# EAGLE design ESP32-XTonUINO (EAGLE 6.6.0)
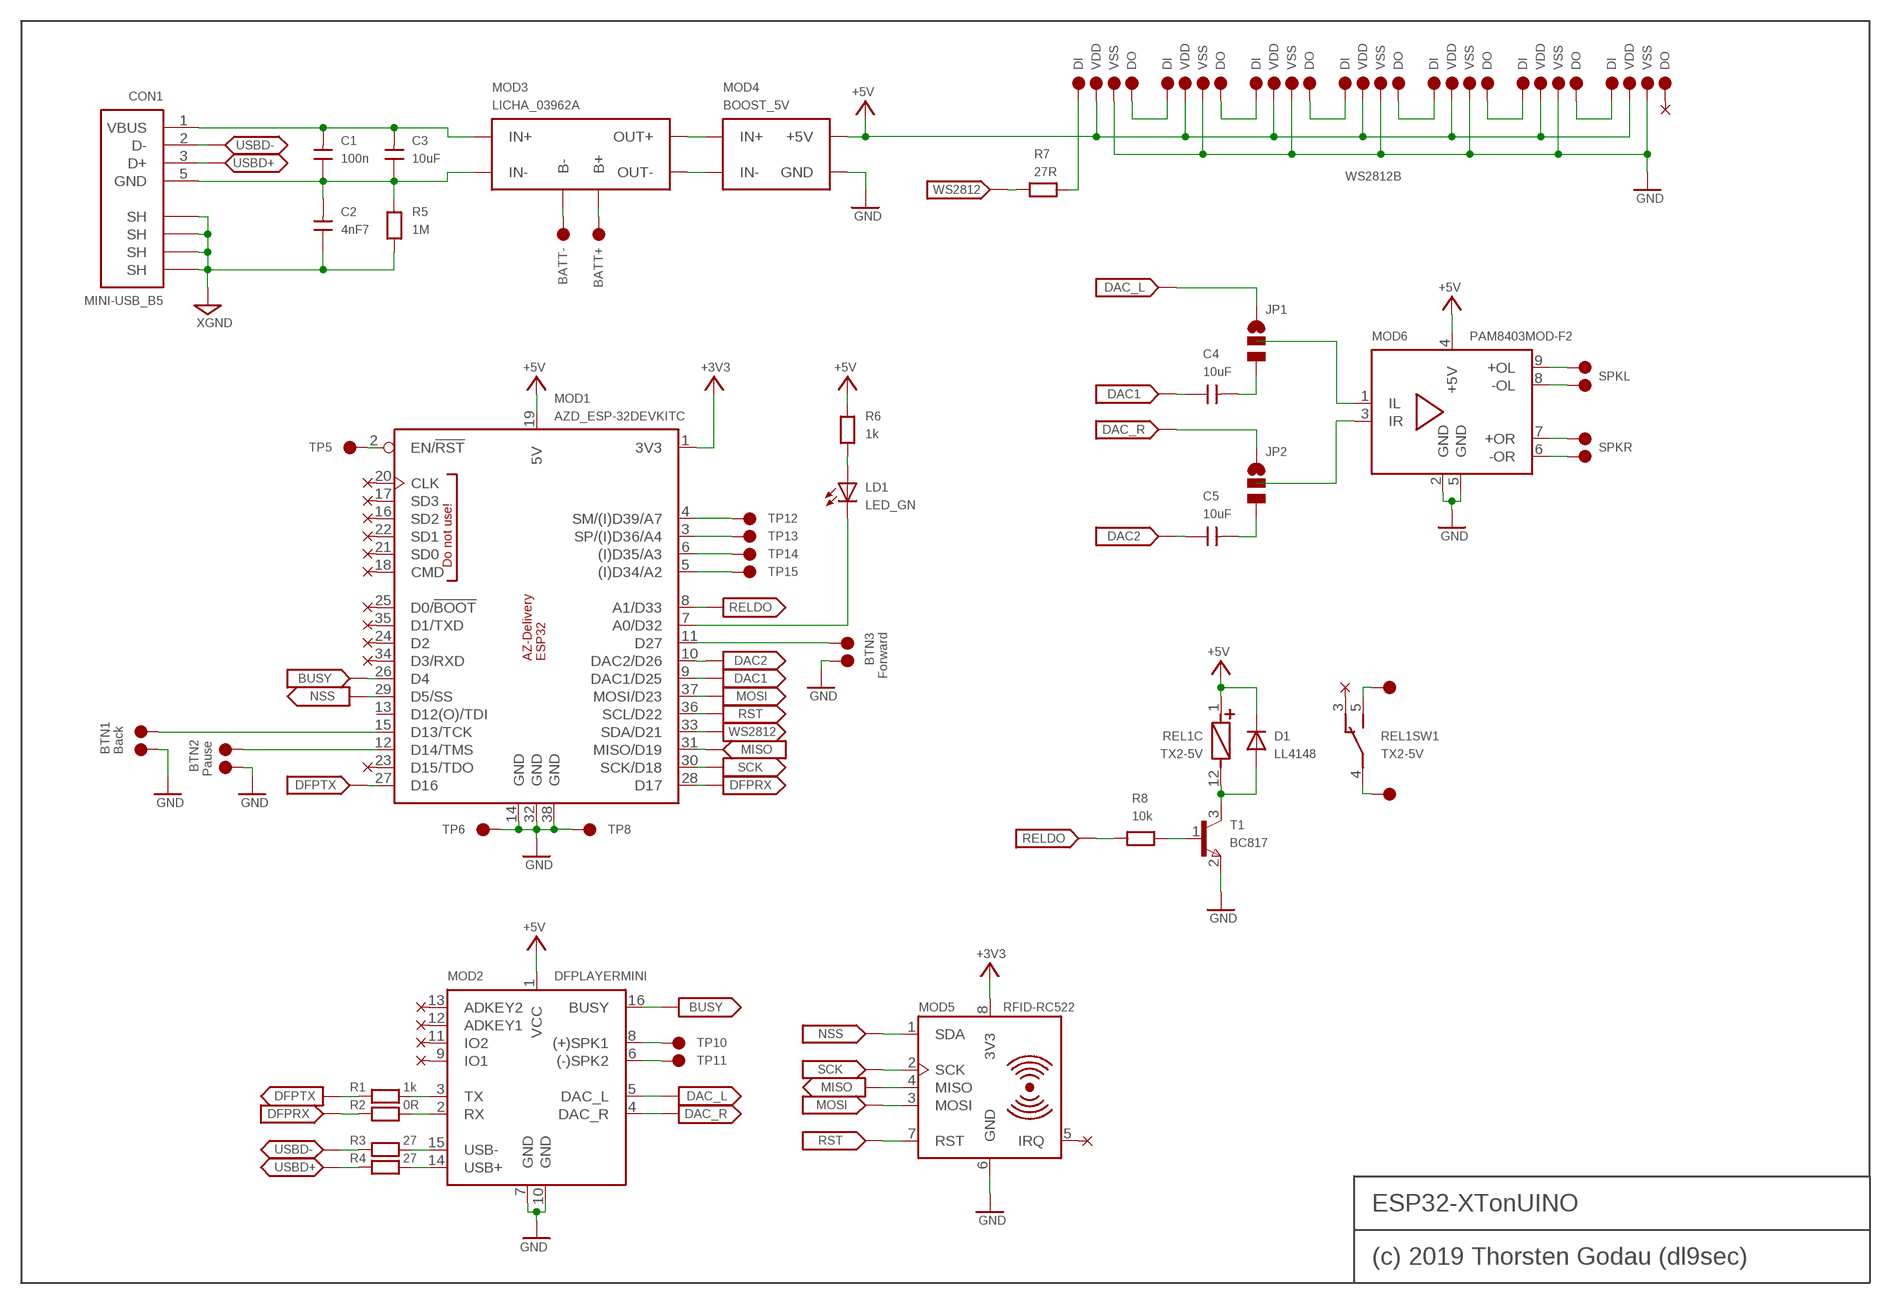
[diagram p0: schematic, sheet 1]

## Parts
C1  100n  C0805  [0805]
C2  4nF7  C0805  [0805]
C3  10uF  C0805  [0805]
C4  10uF  C0805  [0805]
C5  10uF  C0805  [0805]
CON1  MINI-USB_B5  [MINIUSB_B5]
D1  LL4148  [MINIMELF]
JP1  JUMPER_1X3SMD  [JUMPER_1X3_SMD]
JP2  JUMPER_1X3SMD  [JUMPER_1X3_SMD]
LD1  LED_GN  LED_3MM_GN_H  [LED3MMH]
MOD1  AZD_ESP-32DEVKITC  [AZD_ESP-32DEVKITC]
MOD2  DFPLAYERMINI  [DFPLAYERMINI]
MOD3  LICHA_03962A  [LICHA_03962A]
MOD4  BOOST_5V  [BOOST_5V]
MOD5  RFID-RC522  [RFID-RC522]
MOD6  PAM8403MOD-F2  [PAM8403MOD2]
R1  1k  R0805  [0805]
R2  0R  R0805  [0805]
R3  27  R0805  [0805]
R4  27  R0805  [0805]
R5  1M  R0805  [0805]
R6  1k  R0805  [0805]
R7  27R  R0805  [0805]
R8  10k  R0805  [0805]
REL1  TX2-5V  [RELTX2]
T1  BC817  BTUN  [SOT23]
TP1  TESTPINTHT1  [TESTPIN_THT1]
TP2  TESTPINTHT1  [TESTPIN_THT1]
TP3  TESTPINTHT1  [TESTPIN_THT1]
TP4  TESTPINTHT1  [TESTPIN_THT1]
TP5  TESTPINTHT1  [TESTPIN_THT1]
TP6  TESTPINTHT1  [TESTPIN_THT1]
TP7  TESTPINTHT1  [TESTPIN_THT1]
TP8  TESTPINTHT1  [TESTPIN_THT1]
TP9  TESTPINTHT1  [TESTPIN_THT1]
TP10  TESTPINTHT2  [TESTPIN_THT2]
TP11  TESTPINTHT2  [TESTPIN_THT2]
TP12  TESTPINTHT1  [TESTPIN_THT1]
TP13  TESTPINTHT1  [TESTPIN_THT1]
TP14  TESTPINTHT1  [TESTPIN_THT1]
TP15  TESTPINTHT1  [TESTPIN_THT1]
TP16  TESTPINTHT1  [TESTPIN_THT1]
TP17  TESTPINTHT1  [TESTPIN_THT1]
TP18  TESTPINTHT1  [TESTPIN_THT1]
TP19  TESTPINTHT1  [TESTPIN_THT1]
TP20  TESTPINTHT1  [TESTPIN_THT1]
TP21  TESTPINTHT1  [TESTPIN_THT1]
TP22  TESTPINTHT1  [TESTPIN_THT1]
TP23  TESTPINTHT1  [TESTPIN_THT1]
TP24  TESTPINTHT1  [TESTPIN_THT1]
TP25  TESTPINTHT1  [TESTPIN_THT1]
TP26  TESTPINTHT1  [TESTPIN_THT1]
TP27  TESTPINTHT1  [TESTPIN_THT1]
TP28  TESTPINTHT1  [TESTPIN_THT1]
TP29  TESTPINTHT1  [TESTPIN_THT1]
TP30  TESTPINTHT1  [TESTPIN_THT1]
TP31  TESTPINTHT1  [TESTPIN_THT1]
TP32  TESTPINTHT1  [TESTPIN_THT1]
TP33  TESTPINTHT1  [TESTPIN_THT1]
TP34  TESTPINTHT1  [TESTPIN_THT1]
TP35  TESTPINTHT1  [TESTPIN_THT1]
TP36  TESTPINTHT1  [TESTPIN_THT1]
TP37  TESTPINTHT1  [TESTPIN_THT1]
TP38  TESTPINTHT1  [TESTPIN_THT1]
TP39  TESTPINTHT1  [TESTPIN_THT1]
TP40  TESTPINTHT1  [TESTPIN_THT1]
TP41  TESTPINTHT2  [TESTPIN_THT2]
TP42  TESTPINTHT2  [TESTPIN_THT2]
TP43  TESTPINTHT2  [TESTPIN_THT2]
TP44  TESTPINTHT2  [TESTPIN_THT2]
TP45  TESTPINTHT1  [TESTPIN_THT1]
TP46  TESTPINTHT2  [TESTPIN_THT2]
TP47  TESTPINTHT2  [TESTPIN_THT2]
TP48  TESTPINTHT1  [TESTPIN_THT1]
TP49  TESTPINTHT1  [TESTPIN_THT1]
TP50  TESTPINTHT1  [TESTPIN_THT1]
TP51  TESTPINTHT1  [TESTPIN_THT1]

## Nets
+3V3: MOD1.1(3V3) MOD5.8(3V3)
+5V: D1.K MOD1.19(5V) MOD2.1(VCC) MOD4.+5V MOD6.4(+5V) R6.2 REL1.1(C:+) TP19.1(TP) TP23.1(TP) TP27.1(TP) TP31.1(TP) TP35.1(TP) TP39.1(TP) TP49.1(TP)
BATT+: MOD3.B+ TP9.1(TP)
BATT-: MOD3.B- TP7.1(TP)
BTN1: MOD1.15(D13/TCK) TP1.1(TP)
BTN2: MOD1.12(D14/TMS) TP3.1(TP)
BTN3: MOD1.11(D27) TP16.1(TP)
BUSY: MOD1.26(D4) MOD2.16(BUSY)
DAC1: C4.1 MOD1.9(DAC1/D25)
DAC2: C5.1 MOD1.10(DAC2/D26)
DAC_L: JP1.1 MOD2.5(DAC_L)
DAC_R: JP2.1 MOD2.4(DAC_R)
DFPRX: MOD1.28(D17) R2.1
DFPTX: MOD1.27(D16) R1.1
GND: MOD1.14(GND) MOD1.32(GND) MOD1.38(GND) MOD2.7(GND) MOD2.10(GND) MOD4.GND MOD5.6(GND) MOD6.2(GND) MOD6.5(GND) T1.2(E) TP2.1(TP) TP4.1(TP) TP6.1(TP) TP8.1(TP) TP17.1(TP) TP20.1(TP) TP24.1(TP) TP28.1(TP) TP32.1(TP) TP36.1(TP) TP40.1(TP) TP50.1(TP)
MISO: MOD1.31(MISO/D19) MOD5.4(MISO)
MOSI: MOD1.37(MOSI/D23) MOD5.3(MOSI)
N$1: C1.1 C2.2 C3.1 CON1.5(GND) MOD3.IN- R5.2
N$2: MOD2.14(USB+) R4.2
N$3: MOD1.4(SM/(I)D39/A7) TP12.1(TP)
N$4: MOD1.3(SP/(I)D36/A4) TP13.1(TP)
N$5: MOD3.OUT- MOD4.IN-
N$6: MOD1.6((I)D35/A3) TP14.1(TP)
N$7: MOD1.5((I)D34/A2) TP15.1(TP)
N$8: MOD1.2(EN/!RST!) TP5.1(TP)
N$9: C4.2 JP1.3
N$10: LD1.A R6.1
N$11: JP2.2 MOD6.3(IR)
N$12: MOD2.15(USB-) R3.2
N$13: JP1.2 MOD6.1(IL)
N$14: C5.2 JP2.3
N$15: TP21.1(TP) TP22.1(TP)
N$16: MOD6.9(+OL) TP41.1(TP)
N$17: MOD2.2(RX) R2.2
N$18: MOD2.3(TX) R1.2
N$19: MOD6.8(-OL) TP42.1(TP)
N$20: MOD6.7(+OR) TP43.1(TP)
N$21: MOD6.6(-OR) TP44.1(TP)
N$22: TP25.1(TP) TP26.1(TP)
N$23: TP29.1(TP) TP30.1(TP)
N$24: TP33.1(TP) TP34.1(TP)
N$25: TP37.1(TP) TP38.1(TP)
N$26: TP45.1(TP) TP48.1(TP)
N$27: REL1.4(SW1:COM) TP47.1(TP)
N$28: REL1.5(SW1:NO) TP46.1(TP)
N$29: R7.2 TP18.1(TP)
N$30: D1.A REL1.12(C:-) T1.3(C)
N$31: R8.2 T1.1(B)
NLED: LD1.K MOD1.7(A0/D32)
NSS: MOD1.29(D5/SS) MOD5.1(SDA)
OUT+: MOD3.OUT+ MOD4.IN+
RELDO: MOD1.8(A1/D33) R8.1
RST: MOD1.36(SCL/D22) MOD5.7(RST)
SCK: MOD1.30(SCK/D18) MOD5.2(SCK)
SPK+: MOD2.8((+)SPK1) TP10.1(TP)
SPK-: MOD2.6((-)SPK2) TP11.1(TP)
USBD+: CON1.3(D+) R4.1
USBD-: CON1.2(D-) R3.1
VBUS: C1.2 C3.2 CON1.1(VBUS) MOD3.IN+
WS2812: MOD1.33(SDA/D21) R7.1
XGND: C2.1 CON1.S1(SH) CON1.S2(SH) CON1.S3(SH) CON1.S4(SH) R5.1
Unconnected: MOD1.13(D12(O)/TDI) MOD1.16(SD2) MOD1.17(SD3) MOD1.18(CMD) MOD1.20(CLK) MOD1.21(SD0) MOD1.22(SD1) MOD1.23(D15/TDO) MOD1.24(D2) MOD1.25(D0/!BOOT!) MOD1.34(D3/RXD) MOD1.35(D1/TXD) MOD2.9(IO1) MOD2.11(IO2) MOD2.12(ADKEY1) MOD2.13(ADKEY2) MOD5.5(IRQ) REL1.3(SW1:NC) REL1.8(SW2:NO) REL1.9(SW2:COM) REL1.10(SW2:NC) TP51.1(TP)

## Notes on the sheet
- DI | VDD | VSS | DO | DI | VDD | VSS | DO | DI | VDD | VSS | DO | DI | VDD | VSS | DO | DI | VDD | VSS | DO | DI | VDD | VSS | DO | DI | VDD | VSS | DO
- WS2812B
- BATT- | BATT+
- SPKL
- SPKR
- BTN3
- Forward
- BTN1 | Back
- BTN2
- Pause
- ESP32-XTonUINO
- (c) 2019 Thorsten Godau (dl9sec)

## Library data of the parts
C1-C5 = dl9sec_public:C: Capacity
CON1 = dl9sec_public:MINI-USB_B5: KYCON Mini-USB Type B SMT, 5-pins 4 pins for shield
D1 = dl9sec_public:LL4148: LL4148 General purpose diode
JP1 JP2 = dl9sec_public:JUMPER_1X3: Jumper 1x3
LD1 = dl9sec_public:LED_3MM_GN: LED (green) Kingbright L-934SGC
MOD1 = dl9sec_public:AZD_ESP-32DEVKITC: AZ-Delivery ESP-32 DevKitC https://www.az-delivery.de/products/esp32-developmentboard?ls=de&cache=false https://cdn.shopify.com/s/files/1/1509/1638/files/ESP_-_32_NodeMCU_Developmentboard_Pinout_Diagram.jpg?4479111012146266271 https://bibliothek.az-delivery.de/wp-content/uploads/2018/01/4-AZ-Delivery_ESP32-Development-Board_Startertutorial.pdf
MOD2 = dl9sec_public:DFPLAYERMINI: AZ-Delivery DFPlayer Mini https://www.az-delivery.de/products/mp3-player-modul
MOD3 = dl9sec_public:LICHA_03962A: LiIon/LiPo 1-cell charger 1A with UVP TP4056, DW01A/FS8205A
MOD4 = dl9sec_public:BOOST_5V: Boost converter module 1..5V -> 5V
MOD5 = dl9sec_public:RFID-RC522: AZ-Dekivery RFID-RC522 https://www.az-delivery.de/products/rfid-set
MOD6 = dl9sec_public:PAM8403MOD: PAM8403 module 2x3W@4R
R1-R8 = dl9sec_public:R: Resistor
REL1 = dl9sec_public:TX2: Panasonix TX2 relay https://www.panasonic-electric-works.com/pew/de/downloads/ds_61022_en_tx.pdf
T1 = dl9sec_public:BTUN: Bipolar transistor universal NPN BTUN
TP1-TP51 = dl9sec_public:TESTPIN: Testpin/Testpad

## Board
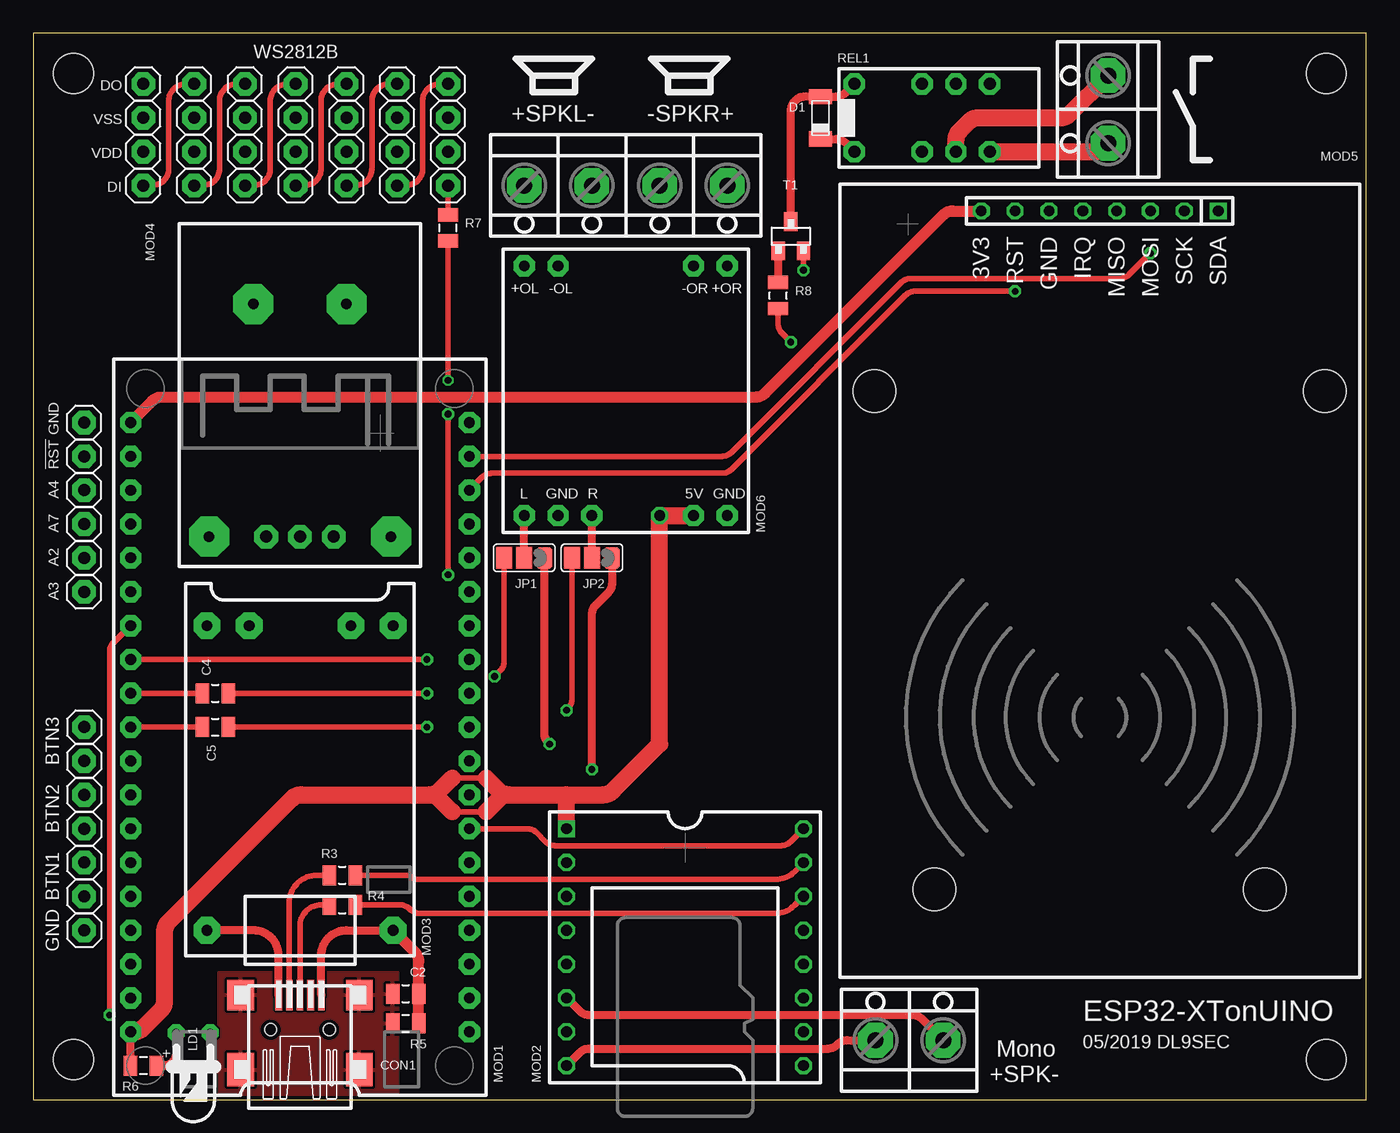
[diagram p1: board, top side]
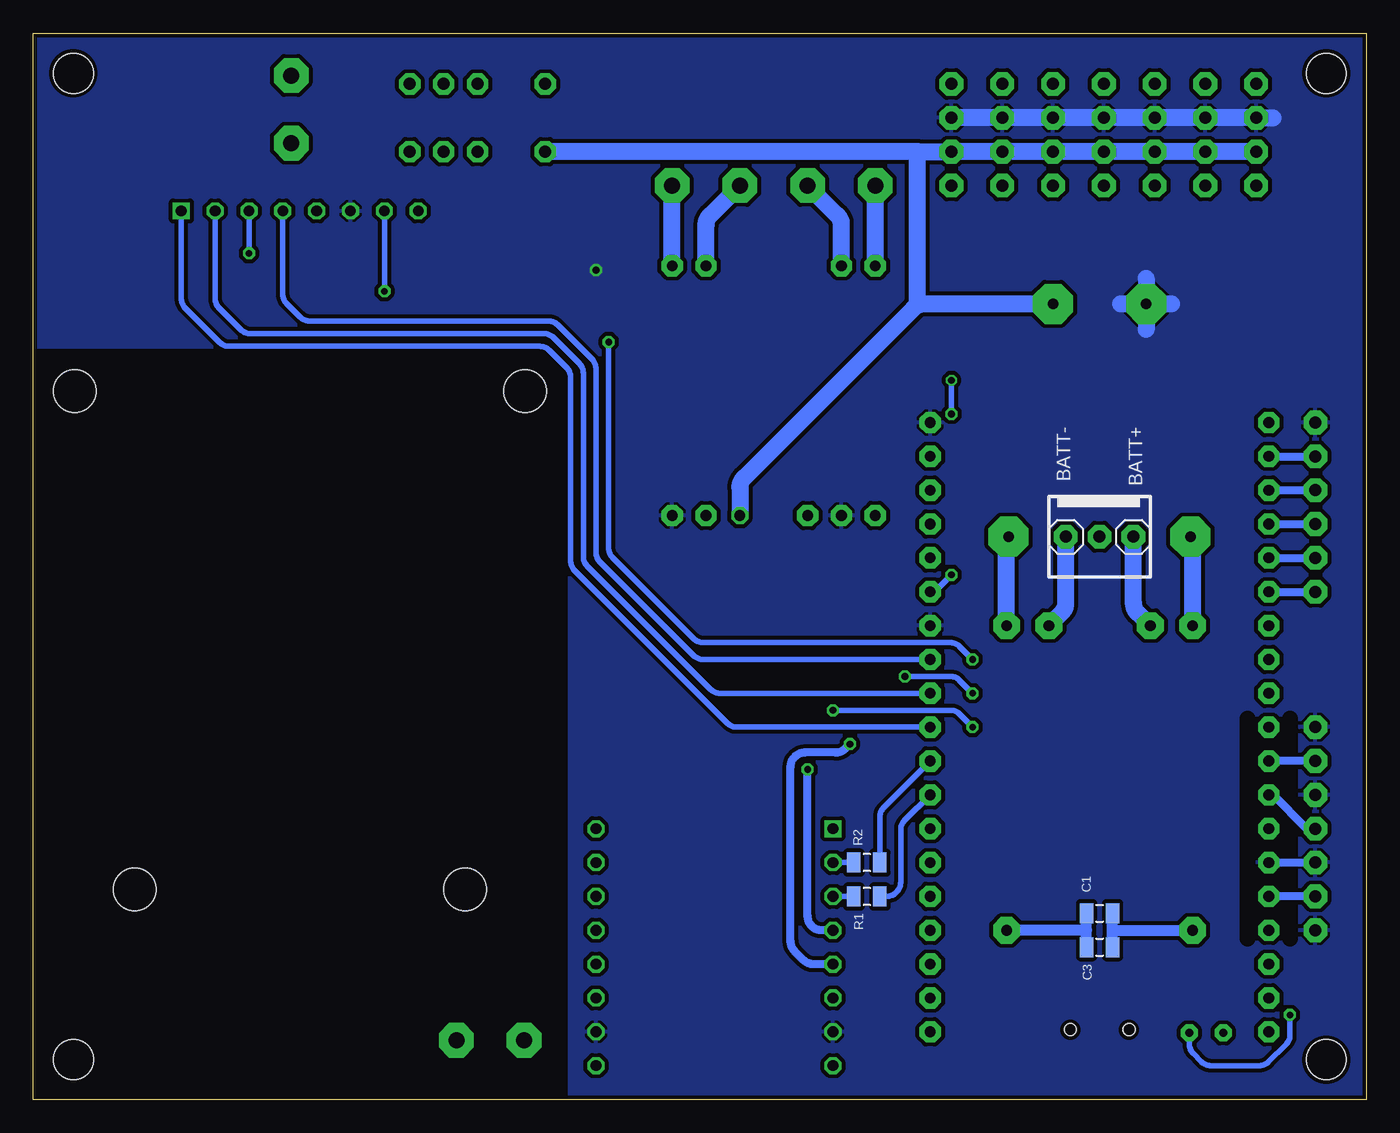
[diagram p2: board, bottom side, seen from below]

Size 100 x 80 mm. Coordinates in mm from the lower left corner, seen from the top.
Outline: 0,0 100,0 100,80 0,80 0,0
Copper layers (1*16): Top 0.035mm / dielectric 1.5mm / Bottom 0.035mm
Design rules "PCB-POOL Standard_tg": minimum track width 0.15mm, minimum drill 0.3mm, track to track 0.15mm, track to pad 0.15mm, pad to pad 0.15mm, via to via 0.15mm, smd to smd 0.15mm, copper to edge 0.3mm, drill to drill 0.2mm, minimum pad ring 0.2mm, minimum via ring 0.15mm, stop-mask expansion 0.075mm, vias tented up to drill 0.5mm, thermal gap 0.2mm
Holes 3 mm at 3,3 3,77 97,77 97,3
bRestrict: 21 lines

### Footprints (pad centres in the part's own frame; a part is rotated, then mirrored left to right if it is on the bottom)
0805 = smd 1 x 1.5: 1 -0.976,0; 2 0.976,0
MINIUSB_B5 = smd 2.3 x 0.5: 1 7.85,1.6; 2 7.85,0.8; 3 7.85,0; 4 7.85,-0.8; 5 7.85,-1.6 | smd 2.5 x 2: S1 2.25,4.45; S3 2.25,-4.45 | smd 2.3 x 2: S2 7.85,4.45; S4 7.85,-4.45 | hole 0.9: 5.25,2.2; 5.25,-2.2
MINIMELF = smd 1.143 x 1.702: A 1.591,0; K -1.591,0
JUMPER_1X3_SMD = smd 1.2 x 1.6: 1 -1.5,0; 2 0,0; 3 1.5,0
LED3MMH = drill 0.61 pad 1.27 octagon: A -1.27,0; K 1.27,0
AZD_ESP-32DEVKITC = drill 0.8 pad 1.6 octagon: 1 -12.7,22.86; 2 -12.7,20.32; 3 -12.7,17.78; 4 -12.7,15.24; 5 -12.7,12.7; 6 -12.7,10.16; 7 -12.7,7.62; 8 -12.7,5.08; 9 -12.7,2.54; 10 -12.7,0; 11 -12.7,-2.54; 12 -12.7,-5.08; 13 -12.7,-7.62; 14 -12.7,-10.16; 15 -12.7,-12.7; 16 -12.7,-15.24; 17 -12.7,-17.78; 18 -12.7,-20.32; 19 -12.7,-22.86; 20 12.7,-22.86; 21 12.7,-20.32; 22 12.7,-17.78; 23 12.7,-15.24; 24 12.7,-12.7; 25 12.7,-10.16; 26 12.7,-7.62; 27 12.7,-5.08; 28 12.7,-2.54; 29 12.7,0; 30 12.7,2.54; 31 12.7,5.08; 32 12.7,7.62; 33 12.7,10.16; 34 12.7,12.7; 35 12.7,15.24; 36 12.7,17.78; 37 12.7,20.32; 38 12.7,22.86
DFPLAYERMINI = drill 0.8 pad 1.27 square: 1 0,0 | drill 0.8 pad 1.27 octagon: 2 2.54,0; 3 5.08,0; 4 7.62,0; 5 10.16,0; 6 12.7,0; 7 15.24,0; 8 17.78,0; 9 17.78,17.78; 10 15.24,17.78; 11 12.7,17.78; 12 10.16,17.78; 13 7.62,17.78; 14 5.08,17.78; 15 2.54,17.78; 16 0,17.78
LICHA_03962A = drill 0.8 pad 2 octagon: B+ 24.765,12.383; B- 24.765,4.763; IN+ 1.905,15.557; IN- 1.905,1.587; OUT+ 24.765,15.557; OUT- 24.765,1.587
BOOST_5V = drill 0.8 pad 3 octagon: +5V 19.685,5.556; GND 19.685,12.541; IN+ 2.223,15.875; IN- 2.223,2.223
RFID-RC522 = drill 0.8 pad 1.27 square: 1 0,8.89 | drill 0.8 pad 1.27 octagon: 2 0,6.35; 3 0,3.81; 4 0,1.27; 5 0,-1.27; 6 0,-3.81; 7 0,-6.35; 8 0,-8.89 | hole 3.2: 50.9,12.4; 50.9,-12.4; 13.5,-16.9; 13.5,16.9
PAM8403MOD2 = drill 0.8 pad 1.6 octagon: 1 0,0; 2 2.54,0; 3 5.08,0; 4 12.7,0; 5 15.24,0; 6 15.24,18.733; 7 12.7,18.733; 8 2.54,18.733; 9 0,18.733
RELTX2 = drill 0.9 pad 1.6 octagon: 1 -2.54,6.35; 3 -2.54,1.27; 4 -2.54,-1.27; 5 -2.54,-3.81; 8 2.54,-3.81; 9 2.54,-1.27; 10 2.54,1.27; 12 2.54,6.35
SOT23 = smd 1 x 1.4: 1 -0.95,-1.1; 2 0.95,-1.1; 3 0,1.1
TESTPIN_THT1 = drill 0.9 pad 1.778 octagon: 1 0,0
TESTPIN_THT2 = drill 1.2 pad 2.6 octagon: 1 0,0

### Placement (x,y rotation side)
C1  20,13.97 0 bottom
C2  27.94,7.94 0 top
C3  20,11.43 0 bottom
C4  13.65,30.48 0 top
C5  13.65,27.94 0 top
CON1  20,0 90 top
D1  59.05,73.66 90 top
JP1  36.83,40.64 180 top
JP2  41.91,40.64 180 top
LD1  12,5 0 top
MOD1  20,27.94 0 top
MOD2  40.01,20.32 270 top
MOD3  28.57,10.79 90 top
MOD4  29.05,40.01 90 top
MOD5  80.01,66.67 270 top
MOD6  36.83,43.81 0 top
R1  37.47,15.24 180 bottom
R2  37.47,17.78 180 bottom
R3  23.18,16.83 0 top
R4  23.18,14.61 0 top
R5  27.94,5.71 0 top
R6  8.26,2.54 180 top
R7  31.11,65.41 90 top
R8  55.88,60.33 90 top
REL1  67.94,73.66 90 top
T1  56.83,64.77 0 top
TP1  3.81,15.24 0 top
TP2  3.81,17.78 0 top
TP3  3.81,20.32 0 top
TP4  3.81,22.86 0 top
TP5  3.81,48.26 180 top
TP6  3.81,12.7 0 top
TP7  22.54,42.23 90 bottom
TP8  3.81,50.8 180 top
TP9  17.46,42.23 90 bottom
TP10  63.18,4.45 0 top
TP11  68.26,4.45 0 top
TP12  3.81,43.18 180 top
TP13  3.81,45.72 180 top
TP14  3.81,38.1 180 top
TP15  3.81,40.64 180 top
TP16  3.81,25.4 0 top
TP17  3.81,27.94 0 top
TP18  31.11,68.58 180 top
TP19  31.11,71.12 180 top
TP20  31.11,73.66 180 top
TP21  31.11,76.2 180 top
TP22  27.3,68.58 180 top
TP23  27.3,71.12 180 top
TP24  27.3,73.66 180 top
TP25  27.3,76.2 180 top
TP26  23.5,68.58 180 top
TP27  23.5,71.12 180 top
TP28  23.5,73.66 180 top
TP29  23.5,76.2 180 top
TP30  19.68,68.58 180 top
TP31  19.68,71.12 180 top
TP32  19.68,73.66 180 top
TP33  19.68,76.2 180 top
TP34  15.88,68.58 180 top
TP35  15.88,71.12 180 top
TP36  15.88,73.66 180 top
TP37  15.88,76.2 180 top
TP38  12.06,68.58 180 top
TP39  12.06,71.12 180 top
TP40  12.06,73.66 180 top
TP41  36.83,68.58 180 top
TP42  41.91,68.58 180 top
TP43  46.99,68.58 180 top
TP44  52.07,68.58 180 top
TP45  12.06,76.2 180 top
TP46  80.64,71.75 90 top
TP47  80.64,76.83 90 top
TP48  8.26,68.58 180 top
TP49  8.26,71.12 180 top
TP50  8.26,73.66 180 top
TP51  8.26,76.2 180 top

### Tracks (layer width: path | path; a pad name or v marks a point on that pad's centre or on a via)
+3V3
  Top 0.813: MOD5.8 68.99,66.67 arc45 68.29,66.38 54.9,53 arc-45 54.2,52.7 9.62,52.7 arc45 8.91,52.41 MOD1.1
+5V  (via drill 0.8 pad 1.27)
  Top 0.406: 31.43,24.13 33.97,24.13 | 31.43,21.59 33.97,21.59
  Top 0.61: R6.2 arc45 7.3,2.6 MOD1.19 | D1.K 60.23,72.07 arc-45 60.94,71.78 REL1.1
  Top 1.27: 29.75,22.86 20.1,22.86 arc45 19.39,22.57 10.13,13.31 arc45 9.84,12.6 9.84,7.4 arc-45 9.55,6.69 8.23,5.37 arc-45 7.52,5.08 MOD1.19 | 29.75,22.86 arc45 30.45,23.15 31.43,24.13 | 33.97,24.13 34.95,23.15 arc45 35.66,22.86 | 29.75,22.86 arc-45 30.45,22.57 31.43,21.59 | 33.97,21.59 35.24,22.86 35.66,22.86 | 35.66,22.86 40.01,22.86 | MOD2.1 40.01,22.86 | MOD6.4 v46.99,43.81 46.99,26.67 43.47,23.15 arc-45 42.77,22.86 40.01,22.86
  Bottom 1.27: v46.99,43.81 46.99,45.94 arc45 46.7,46.65 33.95,59.4 arc45 33.24,59.69 MOD4.+5V 33.66,59.69 33.66,71.12 | TP49.1 TP39.1 TP35.1 TP31.1 TP27.1 TP23.1 TP19.1 33.66,71.12 | 33.66,71.12 REL1.1
BATT+
  Bottom 1.27: MOD3.B+ 17.17,36.54 arc45 17.46,37.24 TP9.1
BATT-
  Bottom 1.27: MOD3.B- 22.84,36.54 arc-45 22.54,37.24 TP7.1
BTN1
  Bottom 0.61: TP1.1 MOD1.15
BTN2
  Bottom 0.61: MOD1.12 6.99,22.86 4.45,20.32 TP3.1
BTN3
  Bottom 0.61: TP16.1 MOD1.11
BUSY
  Top 0.406: MOD1.26 37.05,20.32 arc-45 37.76,20.03 38.44,19.34 arc45 39.15,19.05 56.1,19.05 arc45 56.81,19.34 MOD2.16
DAC1
  Top 0.406: C4.1 MOD1.9
DAC2
  Top 0.406: C5.1 MOD1.10
DAC_L  (via drill 0.5 pad 0.9)
  Top 0.61: JP1.1 38.33,27.49 arc45 38.62,26.78 v38.73,26.67
  Bottom 0.61: MOD2.5 41.5,10.16 arc45 42.2,10.45 42.89,11.14 arc45 43.18,11.84 43.18,24.99 arc45 42.89,25.69 42.84,25.74 arc45 42.13,26.04 39.78,26.04 arc-45 39.08,26.33 v38.73,26.67
DAC_R  (via drill 0.5 pad 0.9)
  Top 0.61: v41.91,24.77 41.91,36.42 arc-45 42.2,37.12 43.18,38.1 arc45 43.41,38.66 JP2.1
  Bottom 0.61: MOD2.4 40.86,12.7 arc45 41.57,12.99 41.62,13.04 arc45 41.91,13.75 v41.91,24.77
DFPRX
  Bottom 0.406: R2.1 36.49,21.2 arc45 36.2,21.91 MOD1.28
DFPTX
  Bottom 0.406: R1.1 35.97,15.24 arc-45 35.27,15.53 35.22,15.58 arc-45 34.92,16.29 34.92,20.22 arc45 34.63,20.93 MOD1.27
GND  (via drill 0.5 pad 0.9)
  Top 0.406: T1.2 arc-45 T1.2 v57.78,62.23
  Bottom 0.61: MOD1.14 TP2.1
  Bottom 1.27: TP20.1 TP24.1 TP28.1 TP32.1 TP36.1 TP40.1 TP50.1 6.99,73.66 | 14.61,59.69 18.41,59.69 | 16.51,61.59 16.51,57.78
  pour Bottom (isolate 0.3): 0,80 100,80 100,0 0,0
MISO
  Bottom 0.406: MOD1.31 49.75,33.02 arc45 50.46,33.31 57.49,40.35 arc45 57.78,41.05 57.78,54.83 arc-45 58.08,55.54 60.67,58.13 arc-45 61.37,58.42 79.28,58.42 arc45 79.98,58.71 80.99,59.72 arc45 81.28,60.42 MOD5.4
MOSI  (via drill 0.5 pad 0.9)
  Top 0.406: MOD1.37 51.66,48.26 arc45 52.36,48.55 65.11,61.3 arc-45 65.82,61.59 81.5,61.59 arc45 82.21,61.89 v83.82,63.5
  Bottom 0.406: v83.82,63.5 MOD5.3
N$1
  Top 0.61: CON1.5 21.6,10.8 arc-90 23.5,12.7 MOD3.IN-
  Top 0.813: R5.2 C2.2 28.92,10.36 arc45 28.62,11.06 MOD3.IN-
  Bottom 0.813: C1.1 C3.1 20.98,12.7 MOD3.IN-
N$2
  Top 0.406: R4.2 27.53,14.61 arc-45 28.23,14.31 28.28,14.26 arc45 28.99,13.97 55.69,13.97 arc45 57.1,14.56 MOD2.14
N$3
  Bottom 0.61: MOD1.4 TP12.1
N$4
  Bottom 0.61: MOD1.3 TP13.1
N$5
  Bottom 1.27: MOD3.OUT- 26.99,41.91 arc90 MOD4.IN-
N$6
  Bottom 0.61: MOD1.6 TP14.1
N$7
  Bottom 0.61: MOD1.5 TP15.1
N$8
  Bottom 0.61: MOD1.2 TP5.1
N$9  (via drill 0.5 pad 0.9)
  Top 0.406: v29.53,30.48 C4.2 | v34.61,31.75 35.04,32.18 arc45 35.33,32.89 JP1.3
  Bottom 0.406: v29.53,30.48 30.5,31.46 arc-45 31.21,31.75 v34.61,31.75
N$10
  Top 0.61: R6.1 9.75,2.54 arc45 10.45,2.83 10.48,2.86 arc45 10.73,3.47 LD1.A
N$11
  Top 0.61: JP2.2 MOD6.3
N$12
  Top 0.406: R3.2 28.05,16.83 arc-45 28.4,16.68 28.43,16.66 arc45 28.78,16.51 55.69,16.51 arc45 57.1,17.1 MOD2.15
N$13
  Top 0.61: JP1.2 MOD6.1
N$14  (via drill 0.5 pad 0.9)
  Top 0.406: JP2.3 40.41,30.03 arc-45 40.12,29.32 v40.01,29.21 | v29.53,27.94 C5.2
  Bottom 0.406: v40.01,29.21 31.21,29.21 arc45 30.5,28.92 v29.53,27.94
N$15
  Top 0.406: TP21.1 30.48,76.2 arc90 29.21,74.93 29.21,69.85 arc-90 27.94,68.58 TP22.1
N$16
  Bottom 1.27: MOD6.9 TP41.1
N$17
  Bottom 0.406: R2.2 MOD2.2
N$18
  Bottom 0.406: R1.2 MOD2.3
N$19
  Bottom 1.27: MOD6.8 39.37,65.63 arc-45 39.66,66.33 TP42.1
N$20
  Bottom 1.27: MOD6.7 49.53,65.63 arc45 49.24,66.33 TP43.1
N$21
  Bottom 1.27: MOD6.6 TP44.1
N$22
  Top 0.406: TP25.1 26.67,76.2 arc90 25.4,74.93 25.4,69.85 arc-90 24.13,68.58 TP26.1
N$23
  Top 0.406: TP29.1 22.86,76.2 arc90 21.59,74.93 21.59,69.85 arc-90 20.32,68.58 TP30.1
N$24
  Top 0.406: TP33.1 19.05,76.2 arc90 17.78,74.93 17.78,69.85 arc-90 16.51,68.58 TP34.1
N$25
  Top 0.406: TP37.1 15.24,76.2 arc90 13.97,74.93 13.97,69.85 arc-90 12.7,68.58 TP38.1
N$26
  Top 0.406: TP45.1 11.43,76.2 arc90 10.16,74.93 10.16,69.85 arc-90 8.89,68.58 TP48.1
N$27
  Top 1.27: REL1.4 69.22,71.98 arc-45 69.51,72.68 70.19,73.37 arc-45 70.9,73.66 77.06,73.66 arc45 77.76,73.95 TP47.1
N$28
  Top 1.27: REL1.5 79.6,71.12 arc45 80.3,71.41 TP46.1
N$29
  Top 0.406: R7.2 TP18.1
N$30
  Top 0.406: 57.18,74.96 57.12,74.91
  Top 0.61: T1.3 56.83,74.2 arc-45 57.12,74.91 | 57.18,74.96 arc-45 57.88,75.25 D1.A 60.23,75.25 arc45 60.94,75.54 REL1.12
N$31
  Top 0.61: T1.1 arc45 T1.1 R8.2
N$32  (via drill 0.9 pad 1.78)
  other vias: 20,42.23
NLED  (via drill 0.5 pad 0.9)
  Top 0.406: v5.71,6.35 5.71,33.56 arc-45 6.01,34.27 MOD1.7
  Bottom 0.406: LD1.K 13.27,4.16 arc-45 12.98,3.45 12.36,2.83 arc-45 11.65,2.54 8.03,2.54 arc-45 7.33,2.83 6.01,4.15 arc-45 5.71,4.86 v5.71,6.35
NSS
  Bottom 0.406: MOD5.1 88.9,60.1 arc-45 88.61,59.4 86.02,56.81 arc-45 85.31,56.52 62.01,56.52 arc45 61.3,56.22 59.98,54.9 arc45 59.69,54.2 59.69,40.42 arc-45 59.4,39.71 47.92,28.23 arc-45 47.21,27.94 MOD1.29
OUT+
  Bottom 1.27: MOD3.OUT+ 13.02,42.15 MOD4.IN+
RELDO  (via drill 0.5 pad 0.9)
  Top 0.406: MOD1.8 v29.53,33.02 | v56.83,56.83 56.17,57.49 arc-45 55.88,58.2 R8.1
  Bottom 0.406: v29.53,33.02 30.5,34 arc-45 31.21,34.29 49.75,34.29 arc45 50.46,34.58 56.54,40.66 arc45 56.83,41.37 v56.83,56.83
RST  (via drill 0.5 pad 0.9)
  Top 0.406: MOD1.36 33.68,46.7 arc-45 34.39,46.99 51.66,46.99 arc45 52.36,47.28 65.43,60.35 arc-45 66.14,60.64 v73.66,60.64
  Bottom 0.406: v73.66,60.64 MOD5.7
SCK
  Bottom 0.406: MOD5.2 86.36,60.1 arc-45 86.07,59.4 84.43,57.76 arc-45 83.72,57.47 61.69,57.47 arc45 60.98,57.17 59.03,55.22 arc45 58.74,54.51 58.74,40.74 arc-45 58.45,40.03 49.19,30.77 arc-45 48.48,30.48 MOD1.30
SPK+
  Top 0.61: MOD2.8 40.98,3.52 arc-45 41.69,3.81 59.59,3.81 arc45 60.3,4.1 60.35,4.15 arc-45 61.06,4.45 TP10.1
SPK-
  Top 0.61: MOD2.6 40.98,6.64 arc45 41.69,6.35 65.94,6.35 arc-45 66.65,6.06 TP11.1
USBD+
  Top 0.406: CON1.3 20,13.02 arc-90 21.59,14.61 R4.1
USBD-
  Top 0.406: CON1.2 19.2,14.76 arc-90 21.27,16.83 R3.1
VBUS
  Top 0.61: CON1.1 18.4,10.81 arc90 16.51,12.7 MOD3.IN+
  Bottom 0.813: C1.2 C3.2 19.03,12.7 MOD3.IN+
WS2812  (via drill 0.5, 0.5 pad 0.9)
  Top 0.406: v31.11,39.37 v31.11,51.44 | v31.11,53.98 R7.1
  Bottom 0.406: v31.11,51.44 v31.11,53.98 | MOD1.33 32.38,38.1 v31.11,39.37
XGND
  pour Top: 13.97,0 13.97,9.53 27.3,9.53 27.3,0

### Text on the board
tPlace: WS2812B | DO | VSS | +SPKL- | -SPKR+ | VDD | DI | GND | !RST! | A4 | A7 | A2 | A3 | BTN3 | BTN2 | BTN1 | GND | ESP32-XTonUINO | 05/2019 DL9SEC | Mono | +SPK-
bPlace: BATT+ | BATT-